# EasyEDA Pro project ProPrj_Hitboard PCB v2_right_2026-01-14.epro

# Board PCB1
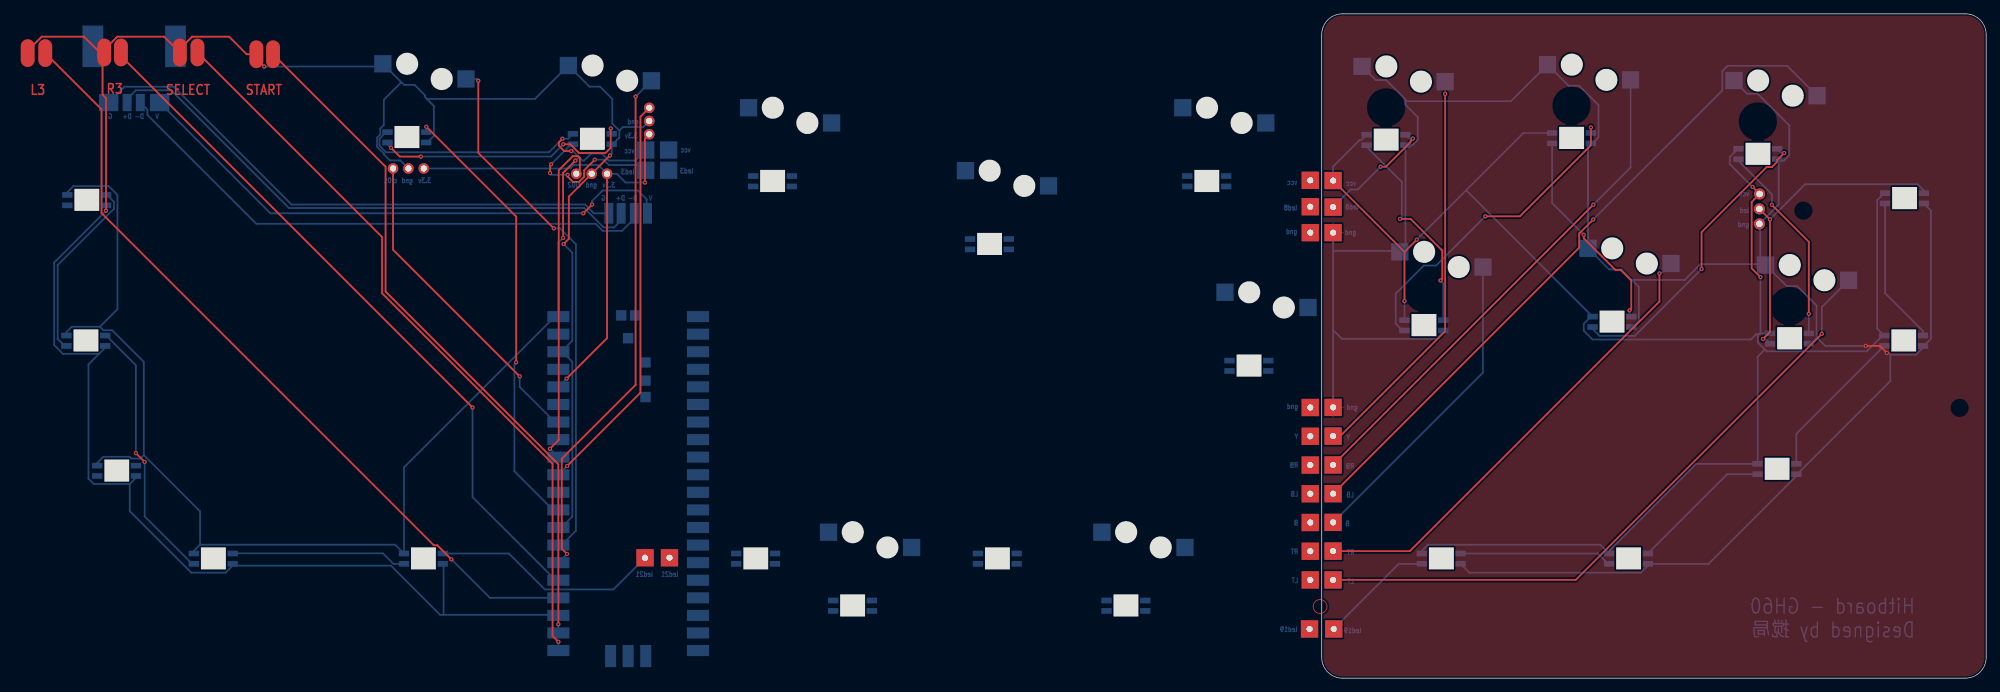
[diagram p0: board, top side]
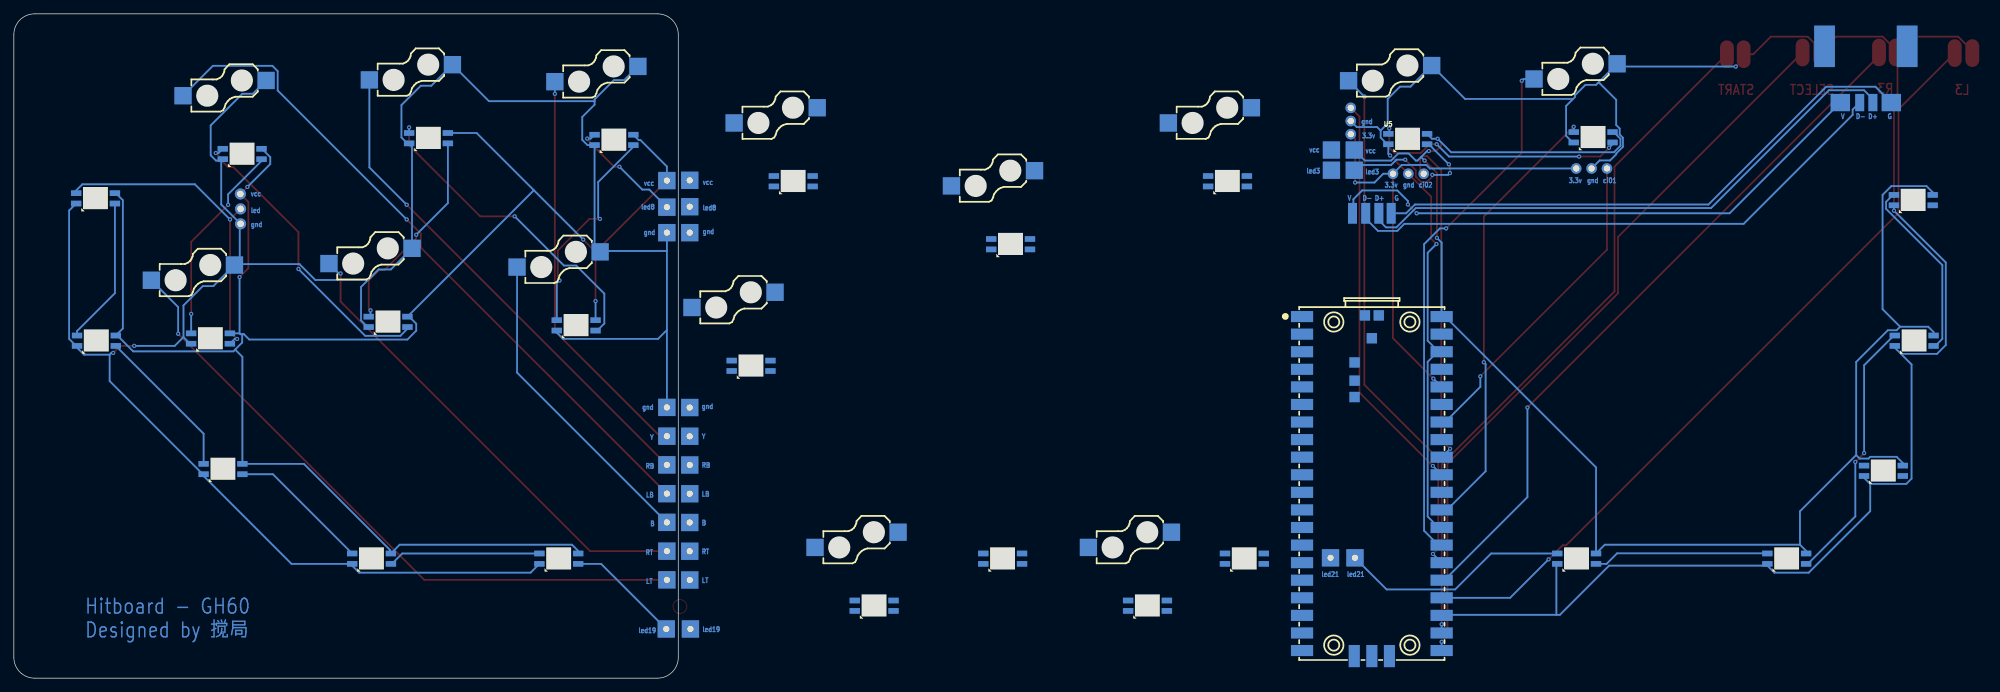
[diagram p1: board, bottom side, seen from below]

Outline 276.35 x 96 mm; copper layers: Top Layer, Bottom Layer. Coordinates in mm from the lower left corner of the outline.
Outline path: 180.35,93 arc(181.23,95.12) 183.35,96 273.35,96 arc(275.47,95.12) 276.35,93 276.35,3 arc(275.47,0.88) 273.35,0 183.35,0 arc(181.23,0.88) 180.35,3 180.35,93
Stack: Top Layer 0.035mm / Dielectric1 1.51mm FR4 er 4.5 / Bottom Layer 0.035mm

## Design rules (mm)
template: JLCPCB Capability(Two Layers Board)
spacing copperThickness1oz (default): track to track 0.102, other pairs 0.152 to 0.3
spacing copperThickness2oz: track to track 0.203, other pairs 0.152 to 0.3
track width copperThickness1oz (default): min 0.127, default 0.254, max 2.54
track width copperThickness2oz: min 0.203, default 0.254, max 2.54
differential pair differentialPair (default): width min 0.127, default 0.254, max 2.54; gap min 0.152, default 0.152
via viaSize (default): diameter min 0.5, default 0.61, max 10; hole min 0.3, default 0.305, max 6.3

## Placement (name value [footprint] x y rotation side)
NOREF  -  [Pad_e295]  50.62 73.65 0 top
NOREF#2  -  [Pad_e677]  4.45 90.42 0 top
NOREF#3  -  [Pad_e13605]  178.69 26.65 0 top
NOREF#4  -  [Pad_e681]  26.42 90.16 0 top
NOREF#5  -  [Pad_e13637]  182 71.91 0 top
NOREF#6  -  [Pad_e70]  182 30.82 0 top
NOREF#7  -  [Pad_e46]  77.09 72.89 0 top
NOREF#8  -  [Pad_e13607]  178.69 18.34 0 top
NOREF#9  -  [Pad_e68]  182 39.13 0 top
NOREF#10  -  [Pad_e48]  72.65 72.89 0 top
NOREF#11  -  [Pad_e693]  81.03 67.18 180 top
NOREF#12  -  [Pad_e689]  77.35 67.18 180 top
NOREF#13  -  [Pad_e676]  -4.08 90.33 0 top
NOREF#14  -  [Pad_e297]  46.17 73.65 0 top
NOREF#15  -  [Pad_e61148]  243.59 65.65 0 top
NOREF#16  -  [Pad_e678]  6.86 90.42 0 top
NOREF#17  -  [Pad_e687]  85.98 76.32 0 top
NOREF#18  -  [Pad_e691]  79.13 67.18 180 top
NOREF#19  -  [Pad_e6738]  82.68 73.4 0 top
NOREF#20  -  [Pad_e4881]  86.11 17.39 0 top
NOREF#21  -  [Pad_e13608]  178.69 14.19 0 top
NOREF#22  -  [Pad_e13602]  178.69 64.38 0 top
NOREF#23  -  [Pad_e13636]  182 64.38 0 top
NOREF#24  -  [Pad_e69]  182 34.97 0 top
NOREF#25  -  [Pad_e686]  12.45 83.18 180 top
NOREF#26  -  [Pad_e4875]  182.09 7.11 0 top
NOREF#27  -  [Pad_e294]  74.87 72.89 0 top
NOREF#28  -  [Pad_e682]  28.84 90.16 0 top
NOREF#29  -  [Pad_e683]  5.09 83.18 180 top
NOREF#30  -  [Pad_e300]  83.19 80.51 0 top
NOREF#31  -  [Pad_e74]  182 14.2 0 top
NOREF#32  -  [Pad_e301]  83.19 82.42 0 top
NOREF#33  -  [Pad_e675]  -6.62 90.33 0 top
NOREF#34  -  [Pad_e13603]  178.69 34.96 0 top
NOREF#35  -  [Pad_e4879]  82.58 17.39 0 top
NOREF#36  -  [Pad_e13606]  178.69 22.49 0 top
NOREF#37  -  [Pad_e71]  182 26.66 0 top
NOREF#38  -  [Pad_e679]  15.37 90.42 0 top
NOREF#39  -  [Pad_e13635]  182 68.07 0 top
NOREF#40  -  [Pad_e61147]  243.59 67.81 0 top
NOREF#41  -  [Pad_e685]  9.66 83.18 180 top
NOREF#42  -  [Pad_e73]  182 18.36 0 top
NOREF#43  -  [Pad_e13601]  178.69 68.13 0 top
NOREF#44  -  [Pad_e61146]  243.62 69.97 0 top
NOREF#45  -  [Pad_e53994]  14.74 91.31 180 top
NOREF#46  -  [Pad_e684]  7.75 83.18 180 top
NOREF#47  -  [Pad_e296]  48.39 73.65 0 top
NOREF#48  -  [Pad_e694]  82.94 67.18 180 top
NOREF#49  -  [Pad_e680]  17.91 90.42 0 top
NOREF#50  -  [Pad_e6736]  82.68 76.32 0 top
NOREF#51  -  [Pad_e53995]  2.8 91.31 180 top
NOREF#52  -  [Pad_e13604]  178.69 30.8 0 top
NOREF#53  -  [Pad_e299]  83.19 78.61 0 top
NOREF#54  -  [Pad_e13600]  178.69 71.94 0 top
NOREF#55  -  [Pad_e6737]  85.98 73.4 0 top
NOREF#56  -  [Pad_e72]  182 22.51 0 top
NOREF#57  -  [Pad_e4877]  178.59 7.11 0 top
NOREF#58  -  [Pad_e114539]  178.69 39.11 0 top
U1  PICO  [COMM-SMD_L51.0-W21.0-P2.54_SC0916]  80.14 27.81 270 bottom
U5  -  [LED-SMD_L3.2-W2.8_YO-WS2812B-3528]  132.34 62.71 180 bottom
U5#2  -  [LED-SMD_L3.2-W2.8_YO-WS2812B-3528]  264.55 69.34 180 bottom
U5#3  -  [LED-SMD_L3.2-W2.8_YO-WS2812B-3528]  264.42 48.76 180 bottom
U5#4  -  [LED-SMD_L3.2-W2.8_YO-WS2812B-3528]  246.13 30.22 180 bottom
U5#5  -  [LED-SMD_L3.2-W2.8_YO-WS2812B-3528]  197.62 17.27 180 bottom
U5#6  -  [LED-SMD_L3.2-W2.8_YO-WS2812B-3528]  133.48 17.27 180 bottom
U5#7  -  [LED-SMD_L3.2-W2.8_YO-WS2812B-3528]  98.56 17.27 180 bottom
U5#8  -  [LED-SMD_L3.2-W2.8_YO-WS2812B-3528]  50.55 17.27 180 bottom
U5#9  -  [LED-SMD_L3.2-W2.8_YO-WS2812B-3528]  20.2 17.27 180 bottom
U5#10  -  [LED-SMD_L3.2-W2.8_YO-WS2812B-3528]  1.78 48.76 180 bottom
U5#11  -  [LED-SMD_L3.2-W2.8_YO-WS2812B-3528]  1.91 69.08 180 bottom
U5#12  -  [LED-SMD_L3.2-W2.8_YO-WS2812B-3528]  6.23 29.97 180 bottom
U5#13  -  [LED-SMD_L3.2-W2.8_YO-WS2812B-3528]  224.67 17.27 180 bottom
U5#14  -  [LED-SMD_L3.2-W2.8_YO-WS2812B-3528]  48.17 78.16 180 bottom
U5#15  -  [LED-SMD_L3.2-W2.8_YO-WS2812B-3528]  74.96 77.91 180 bottom
U5#16  -  [LED-SMD_L3.2-W2.8_YO-WS2812B-3528]  101 71.81 180 bottom
U5#17  -  [LED-SMD_L3.2-W2.8_YO-WS2812B-3528]  112.56 10.47 180 bottom
U5#18  -  [LED-SMD_L3.2-W2.8_YO-WS2812B-3528]  152.05 10.47 180 bottom
U5#19  -  [LED-SMD_L3.2-W2.8_YO-WS2812B-3528]  163.74 71.81 180 bottom
U5#20  -  [LED-SMD_L3.2-W2.8_YO-WS2812B-3528]  169.83 45.14 180 bottom
U5#21  -  [LED-SMD_L3.2-W2.8_YO-WS2812B-3528]  189.64 77.78 180 bottom
U5#22  -  [LED-SMD_L3.2-W2.8_YO-WS2812B-3528]  195.11 50.98 180 bottom
U5#23  -  [LED-SMD_L3.2-W2.8_YO-WS2812B-3528]  216.44 78.03 180 bottom
U5#24  -  [LED-SMD_L3.2-W2.8_YO-WS2812B-3528]  222.28 51.49 180 bottom
U5#25  -  [LED-SMD_L3.2-W2.8_YO-WS2812B-3528]  243.37 75.75 180 bottom
U5#26  -  [LED-SMD_L3.2-W2.8_YO-WS2812B-3528]  247.94 49.08 180 bottom
U6  -  [CONN-SMD_HOTPLUGPAKAGE__C9900010116-1]  134.88 72.24 180 bottom
U6#2  -  [CONN-SMD_HOTPLUGPAKAGE__C9900010116-1]  50.71 87.68 180 bottom
U6#3  -  [CONN-SMD_HOTPLUGPAKAGE__C9900010116-1]  77.5 87.43 180 bottom
U6#4  -  [CONN-SMD_HOTPLUGPAKAGE__C9900010116-1]  103.54 81.33 180 bottom
U6#5  -  [CONN-SMD_HOTPLUGPAKAGE__C9900010116-1]  115.1 19.99 180 bottom
U6#6  -  [CONN-SMD_HOTPLUGPAKAGE__C9900010116-1]  154.59 19.99 180 bottom
U6#7  -  [CONN-SMD_HOTPLUGPAKAGE__C9900010116-1]  166.28 81.33 180 bottom
U6#8  -  [CONN-SMD_HOTPLUGPAKAGE__C9900010116-1]  172.37 54.66 180 bottom
U6#9  -  [CONN-SMD_HOTPLUGPAKAGE__C9900010116-1]  192.18 87.3 180 bottom
U6#10  -  [CONN-SMD_HOTPLUGPAKAGE__C9900010116-1]  197.65 60.51 180 bottom
U6#11  -  [CONN-SMD_HOTPLUGPAKAGE__C9900010116-1]  218.98 87.56 180 bottom
U6#12  -  [CONN-SMD_HOTPLUGPAKAGE__C9900010116-1]  224.82 61.01 180 bottom
U6#13  -  [CONN-SMD_HOTPLUGPAKAGE__C9900010116-1]  245.91 85.27 180 bottom
U6#14  -  [CONN-SMD_HOTPLUGPAKAGE__C9900010116-1]  250.48 58.6 180 bottom

## Footprints (pads in the part's own frame, mm; a bottom-side part is the same pattern mirrored in y, then rotated)
COMM-SMD_L51.0-W21.0-P2.54_SC0916
  rect 1.6x3.2 smd: 1(-24.445,-10.088) 2(-21.905,-10.088) 3(-19.365,-10.088) 4(-16.825,-10.088) 5(-14.285,-10.088) 6(-11.745,-10.088) 7(-9.205,-10.088) 8(-6.665,-10.088) 9(-4.125,-10.088) 10(-1.585,-10.088) 11(0.955,-10.088) 12(3.495,-10.088) 13(6.035,-10.088) 14(8.575,-10.088) 15(11.115,-10.088) 16(13.655,-10.088) 17(16.195,-10.088) 18(18.735,-10.088) 19(21.275,-10.088) 20(23.815,-10.088) 21(23.815,10.088) 22(21.275,10.088) 23(18.735,10.088) 24(16.195,10.088) 25(13.655,10.088) 26(11.115,10.088) 27(8.575,10.088) 28(6.035,10.088) 29(3.495,10.088) 30(0.955,10.088) 31(-1.585,10.088) 32(-4.125,10.088) 33(-6.665,10.088) 34(-9.205,10.088) 35(-11.745,10.088) 36(-14.285,10.088) 37(-16.825,10.088) 38(-19.365,10.088) 39(-21.905,10.088) 40(-24.445,10.088)
  rect 3.2x1.6 smd: 41(24.615,-2.54) 42(24.615,0) 43(24.615,2.54)
  rect 1.5x1.5 smd: TP1(-21.315,0) TP2(-24.615,1) TP3(-24.615,-1) TP4(-17.815,-2.5) TP5(-15.188,-2.5) TP6(-12.815,-2.5)
CONN-SMD_HOTPLUGPAKAGE__C9900010116-1
  rect 2.5x2.5 smd: 1(-6,-1.1) 2(6,1.1)
LED-SMD_L3.2-W2.8_YO-WS2812B-3528
  rect 1.5x0.82 smd: 1(2.8,0.75) 2(2.8,-0.75) 3(-2.8,-0.75) 4(-2.8,0.75)
Pad_e46
  round 1.524 hole 0.914: 1(0,0)
Pad_e48
  round 1.524 hole 0.914: 1(0,0)
Pad_e68
  rect 2.5x2.5 hole 0.9: PTH(0,0)
Pad_e69
  rect 2.5x2.5 hole 0.9: PTH(0,0)
Pad_e70
  rect 2.5x2.5 hole 0.9: PTH(0,0)
Pad_e71
  rect 2.5x2.5 hole 0.9: PTH(0,0)
Pad_e72
  rect 2.5x2.5 hole 0.9: PTH(0,0)
Pad_e73
  rect 2.5x2.5 hole 0.9: PTH(0,0)
Pad_e74
  rect 2.5x2.5 hole 0.9: PTH(0,0)
Pad_e294
  round 1.524 hole 0.914: 1(0,0)
Pad_e295
  round 1.524 hole 0.914: 1(0,0)
Pad_e296
  round 1.524 hole 0.914: 1(0,0)
Pad_e297
  round 1.524 hole 0.914: 1(0,0)
Pad_e299
  round 1.524 hole 0.914: 1(0,0)
Pad_e300
  round 1.524 hole 0.914: 1(0,0)
Pad_e301
  round 1.524 hole 0.914: 1(0,0)
Pad_e675
  oval 2x4 smd: 1(0,0)
Pad_e676
  oval 2x4 smd: 1(0,0)
Pad_e677
  oval 2x4 smd: 1(0,0)
Pad_e678
  oval 2x4 smd: 1(0,0)
Pad_e679
  oval 2x4 smd: 1(0,0)
Pad_e680
  oval 2x4 smd: 1(0,0)
Pad_e681
  oval 2x4 smd: 1(0,0)
Pad_e682
  oval 2x4 smd: 1(0,0)
Pad_e683
  rect 2.8x2.5 smd far side: PTH(0,0)
Pad_e684
  rect 1.3x2.5 smd far side: PTH(0,0)
Pad_e685
  rect 1.3x2.5 smd far side: PTH(0,0)
Pad_e686
  rect 2.8x2.5 smd far side: PTH(0,0)
Pad_e687
  rect 2.5x2.5 smd far side: PTH(0,0)
Pad_e689
  rect 1.3x3 smd far side: PTH(0,0)
Pad_e691
  rect 1.3x3 smd far side: PTH(0,0)
Pad_e693
  rect 1.3x3 smd far side: PTH(0,0)
Pad_e694
  rect 1.3x3 smd far side: PTH(0,0)
Pad_e4875
  rect 2.5x2.5 hole 0.9: PTH(0,0)
Pad_e4877
  rect 2.5x2.5 hole 0.9: PTH(0,0)
Pad_e4879
  rect 2.5x2.5 hole 0.9: PTH(0,0)
Pad_e4881
  rect 2.5x2.5 hole 0.9: PTH(0,0)
Pad_e6736
  rect 2.5x2.5 smd far side: PTH(0,0)
Pad_e6737
  rect 2.5x2.5 smd far side: PTH(0,0)
Pad_e6738
  rect 2.5x2.5 smd far side: PTH(0,0)
Pad_e13600
  rect 2.5x2.5 hole 0.9: PTH(0,0)
Pad_e13601
  rect 2.5x2.5 hole 0.9: PTH(0,0)
Pad_e13602
  rect 2.5x2.5 hole 0.9: PTH(0,0)
Pad_e13603
  rect 2.5x2.5 hole 0.9: PTH(0,0)
Pad_e13604
  rect 2.5x2.5 hole 0.9: PTH(0,0)
Pad_e13605
  rect 2.5x2.5 hole 0.9: PTH(0,0)
Pad_e13606
  rect 2.5x2.5 hole 0.9: PTH(0,0)
Pad_e13607
  rect 2.5x2.5 hole 0.9: PTH(0,0)
Pad_e13608
  rect 2.5x2.5 hole 0.9: PTH(0,0)
Pad_e13635
  rect 2.5x2.5 hole 0.9: PTH(0,0)
Pad_e13636
  rect 2.5x2.5 hole 0.9: PTH(0,0)
Pad_e13637
  rect 2.5x2.5 hole 0.9: PTH(0,0)
Pad_e53994
  rect 3x6 smd far side: PTH(0,0)
Pad_e53995
  rect 3x6 smd far side: PTH(0,0)
Pad_e61146
  round 1.6 hole 0.96: PTH(0,0)
Pad_e61147
  round 1.6 hole 0.96: PTH(0,0)
Pad_e61148
  round 1.6 hole 0.96: PTH(0,0)
Pad_e114539
  rect 2.5x2.5 hole 0.9: PTH(0,0)

## Nets
3V3: NOREF.1 NOREF#7.1 NOREF#53.1 U1.36
GND: NOREF#2.1 NOREF#4.1 NOREF#9.PTH NOREF#15.PTH NOREF#22.PTH NOREF#23.PTH NOREF#27.1 NOREF#30.1 NOREF#33.1 NOREF#38.1 NOREF#47.1 NOREF#58.PTH U1.3 U1.8 U1.18 U1.23 U1.28 U1.38 U5.3 U5#2.3 U5#3.3 U5#4.3 U5#5.3 U5#6.3 U5#7.3 U5#8.3 U5#9.3 U5#10.3 U5#11.3 U5#12.3 U5#13.3 U5#14.3 U5#15.3 U5#16.3 U5#17.3 U5#18.3 U5#19.3 U5#20.3 U5#21.3 U5#22.3 U5#23.3 U5#24.3 U5#25.3 U5#26.3 U6.2 U6#2.2 U6#3.2 U6#4.2 U6#5.2 U6#6.2 U6#7.2 U6#8.2 U6#9.2 U6#10.2 U6#11.2 U6#12.2 U6#13.2 U6#14.2
VCC: NOREF#5.PTH NOREF#17.PTH NOREF#44.PTH NOREF#50.PTH NOREF#54.PTH U1.40 U5.1 U5#2.1 U5#3.1 U5#4.1 U5#5.1 U5#6.1 U5#7.1 U5#8.1 U5#9.1 U5#10.1 U5#11.1 U5#12.1 U5#13.1 U5#14.1 U5#15.1 U5#16.1 U5#17.1 U5#18.1 U5#19.1 U5#20.1 U5#21.1 U5#22.1 U5#23.1 U5#24.1 U5#25.1 U5#26.1
2: U5#14.2 U5#15.4
3: NOREF#19.PTH NOREF#55.PTH U5.4 U5#15.2 U5#16.4
4: U5.2 U5#16.2 U5#17.4
5: U5#17.2 U5#18.4
6: U5#18.2 U5#19.4
7: U5#19.2 U5#20.4
8: NOREF#39.PTH NOREF#43.PTH U5#20.2 U5#21.4
9: U5#21.2 U5#22.4
10: U5#22.2 U5#23.4
11: U5#23.2 U5#24.4
12: U5#24.2 U5#25.4
13: U5#25.2 U5#26.4
14: NOREF#40.PTH U5#2.4 U5#12.4 U5#26.2
15: U5#2.2 U5#3.4 U5#12.2
16: U5#3.2 U5#4.4
17: U5#4.2 U5#13.4
18: U5#5.4 U5#13.2
19: NOREF#26.PTH NOREF#57.PTH U5#5.2 U5#6.4
20: U5#6.2 U5#7.4
21: NOREF#20.PTH NOREF#35.PTH U5#7.2 U5#8.4
22: U5#8.2 U5#9.4
23: U5#9.2 U5#10.4
24: U5#10.2 U5#11.4
25: U5#11.2
A: U1.9 U6#8.1
B: NOREF#36.PTH NOREF#56.PTH U1.10 U6#10.1
BUTTON1: U1.5 U6#5.1
BUTTON2: U1.7 U6.1
D+: NOREF#18.PTH NOREF#46.PTH
D-: NOREF#11.PTH NOREF#41.PTH
DOWN: U1.26 U6#3.1
G: NOREF#12.PTH NOREF#29.PTH
L3: NOREF#13.1 U1.24
LB: NOREF#3.PTH NOREF#37.PTH U1.17 U6#13.1
LED1: U1.29 U5#14.4
LEFT: U1.27 U6#2.1
LINEBUTTON01: NOREF#14.1 U1.34
LINEBUTTON02: NOREF#10.1 U1.32
LINEBUTTON03: NOREF#32.1 U1.31
LT: NOREF#21.PTH NOREF#31.PTH U1.12 U6#14.1
R3: NOREF#16.1 U1.25
RB: NOREF#6.PTH NOREF#52.PTH U1.16 U6#11.1
RIGHT: U1.6 U6#4.1
RT: NOREF#8.PTH NOREF#42.PTH U1.11 U6#12.1
SELECT: NOREF#49.1 U1.21
START: NOREF#28.1 U1.22
UP: U1.4 U6#6.1
V: NOREF#25.PTH NOREF#48.PTH
X: U1.14 U6#7.1
Y: NOREF#24.PTH NOREF#34.PTH U1.15 U6#9.1

Pads without a net: NOREF#45 PTH; NOREF#51 PTH; U1 1 2 13 19 20 30 33 35 37 39 41 42 43 TP1 TP2 TP3 TP4 TP5 TP6

## Via types
v1: diameter 0.61, hole 0.305, Top Layer to Bottom Layer, 60 vias

## Routing (per net, layer and track width the routed paths; a pad name or vN(x,y) marks a point on that pad's centre or on a via; arc(x,y) is an arc through that point)
3V3: length 74.2
  Top Layer w0.254: NOREF#7.1 77.09,49.13 v1(71.25,43.29) ; v1(82.56,71.62) 82.56,77.97 NOREF#53.1
  Bottom Layer w0.254: v1(82.56,71.62) 79.76,71.62 78.49,72.89 NOREF#7.1 75.83,74.16 72.27,74.16 71.76,73.65 NOREF.1 ; v1(71.25,43.29) U1.36
GND: length 699.8
  Top Layer w0.254: 26.3,90.16 NOREF#4.1 ; 26.3,90.16 26.3,89.66 v1(27.57,88.39) ; 26.3,90.16 25.03,90.16 22.48,92.7 17.15,92.7 15.37,90.93 NOREF#38.1 13.09,92.7 6.34,92.7 4.31,90.67 4.31,90.42 ; 4.31,90.42 3.8,90.42 1.51,92.7 -4.58,92.7 -6.62,90.67 NOREF#33.1 ; 4.31,90.42 NOREF#2.1 4.2,90.16 4.2,84.32 4.71,83.81 v1(4.71,67.56) ; v1(258.96,48.02) 260.99,48.02 v1(262,47) ; v1(77.51,75.53) NOREF#27.1 71.57,69.59 71.57,63.49 v1(70.81,62.73)
  Bottom Layer w0.254: 53.48,9.15 69.98,9.15 U1.23 ; 53.48,9.15 53.48,16.39 U5#8.3 ; 53.48,9.15 52.97,9.15 45.86,16.26 23,16.26 ; v1(258.96,48.02) 253.11,48.02 251.84,49.29 ; 262.51,46.75 262.51,42.94 249.17,29.59 249.06,29.59 U5#4.3 248.93,29.22 236.23,16.52 U5#13.3 227.47,16.26 226.45,15.25 201.69,15.25 U5#5.3 ; 262.51,46.75 266.21,46.75 267.11,47.64 267.11,47.9 U5#3.3 267.35,48.01 268.36,49.03 268.36,67.57 267.35,68.59 ; 262.51,46.75 262.26,47 v1(262,47) ; 243.72,59.83 244.35,59.83 U6#14.2 247.53,56.65 249.05,56.65 251.84,53.86 251.84,49.29 ; 243.72,59.83 235.08,59.83 232.79,57.54 225.17,57.54 ; 243.72,59.83 243.72,65.53 NOREF#15.PTH 246.39,68.45 246.39,74.8 ; 246.39,74.8 247.15,74.8 247.91,75.56 247.91,79.88 243.34,84.45 241.83,84.45 U6#13.2 ; 246.39,74.8 U5#25.3 ; v1(70.81,62.73) 72.08,61.46 72.08,48.76 70.55,47.24 ; U5#14.3 51.11,77.41 52.07,78.37 52.07,82.69 51.06,83.7 ; 8.13,28.07 8.13,24.14 17.02,15.25 21.98,15.25 23,16.26 ; 8.13,28.07 2.93,28.07 2.17,28.83 2.17,45.34 3.69,46.86 ; 8.13,28.07 9.03,28.96 U5#12.3 ; U5#10.3 4.58,47.76 3.69,46.86 ; 182,61.73 NOREF#23.PTH ; 182,61.73 191.52,61.73 ; 182,61.73 182,50.3 ; U5#24.3 225.23,50.74 226.19,51.7 226.19,56.53 225.17,57.54 ; U1.38 70.12,47.24 70.55,47.24 ; 78.87,79.13 77.85,80.15 77.85,83.7 76.08,85.48 74.55,85.48 U6#3.2 66.68,83.7 51.06,83.7 ; 78.87,79.13 79.38,79.64 82.32,79.64 NOREF#30.1 ; 78.87,79.13 78.87,78.12 77.91,77.16 U5#15.3 77.76,75.78 v1(77.51,75.53) ; 23,16.26 U5#9.3 ; 70.55,47.24 72.08,45.71 72.08,23.36 70.49,21.77 U1.28 ; 192.44,83.38 192.44,82.87 194.22,81.09 194.22,77.79 193.46,77.03 U5#21.3 192.44,62.66 191.52,61.73 ; 192.44,83.38 192.44,83.63 189.65,86.43 188.16,86.43 U6#9.2 ; 192.44,83.38 207.7,83.38 U6#11.2 216.03,85.61 217.55,85.61 220.35,82.81 220.35,78.13 219.5,77.28 U5#23.3 218.82,76.86 U6#12.2 221.87,59.07 223.65,59.07 225.17,57.54 ; 3.69,46.86 -1.51,46.86 -2.78,48.13 -2.78,60.07 v1(4.71,67.56) 4.71,68.33 ; 251.84,49.29 250.88,48.33 U5#26.3 ; NOREF#47.1 47.23,74.81 45.72,74.81 44.84,75.7 44.84,75.82 43.87,76.79 43.87,78.1 44.34,78.57 44.34,79.43 44.84,79.93 44.84,83.58 47.25,85.99 47.5,85.99 ; 47.5,85.99 47.75,85.74 49.28,85.74 50.8,84.21 50.8,83.96 51.06,83.7 ; 47.5,85.99 U6#2.2 44.31,88.39 v1(27.57,88.39) ; U5#22.3 197.91,49.95 196.98,49.03 183.27,49.03 182,50.3 ; 191.52,61.73 U6#10.2 ; NOREF#9.PTH 182,50.3
VCC: length 491
  Top Layer w0.254: 192.31,61.6 v1(192.31,54.49) ; 192.31,61.6 v1(194.08,63.38) ; 192.31,61.6 NOREF#5.PTH ; v1(242.6,70.99) NOREF#44.PTH 242.47,68.82 242.47,59.22 v1(243.74,57.95) ; v1(71.91,76.17) 70.89,76.17 70.13,76.93 70.13,77.44 v1(70.64,77.95) ; v1(72.52,74.8) 70.75,73.02 v1(70.75,63.62)
  Bottom Layer w0.254: 243.74,49.83 v1(243.74,57.95) ; 243.74,49.83 243.61,49.7 243.36,49.7 ; 243.74,49.83 U5#26.1 ; 73.03,75.31 v1(72.52,74.8) ; 73.03,75.31 73.54,74.8 73.79,74.8 74.81,75.81 76.33,75.81 77.35,74.8 81.16,74.8 NOREF#50.PTH ; 73.03,75.31 72.16,76.17 v1(71.91,76.17) ; -0.89,69.83 -0.89,70.21 0,71.1 5.08,71.1 6.35,69.83 6.35,53.32 3.81,50.78 ; 10.16,32.24 18.29,24.11 18.29,19.29 ; 10.16,32.24 10.16,45.7 5.59,50.27 4.32,50.27 3.81,50.78 ; 10.16,32.24 9.65,31.73 8.38,31.73 8.13,31.99 4.32,31.99 3.43,31.1 U5#12.1 ; 3.81,50.78 -0.25,50.78 -1.02,50.02 U5#10.1 ; 243.36,49.7 243.11,49.7 242.34,48.94 219.48,48.94 218.21,50.21 218.21,51.22 219.23,52.24 U5#24.1 201.23,70.49 201.2,70.49 ; 243.36,49.7 243.36,48.5 244.38,47.48 ; 18.29,19.29 17.4,18.4 U5#9.1 ; 18.29,19.29 46.48,19.29 U5#8.1 47.75,30.46 69.55,52.25 U1.40 70.06,62.93 v1(70.75,63.62) ; 244.38,47.48 244.63,47.23 259.11,47.23 261.39,49.51 U5#3.1 260.6,50.53 260.6,69.07 261.62,70.09 U5#2.1 ; 244.38,47.48 243.33,46.44 U5#4.1 234.44,30.97 222,18.52 222,18.14 U5#13.1 220.6,19.29 195.71,19.29 194.82,18.4 U5#5.1 ; NOREF#5.PTH 182,73.94 185.81,77.75 186.07,77.75 U5#21.1 ; v1(242.6,70.99) 239.3,74.29 239.3,75.31 240.49,76.5 U5#25.1 ; 201.2,70.49 209.49,78.78 U5#23.1 ; 201.2,70.49 v1(194.08,63.38) ; v1(192.31,54.49) U5#22.1 ; U5#14.1 45.18,78.91 44.22,77.95 44.22,76.93 45.16,75.99 68.68,75.99 v1(70.64,77.95) 71.46,77.95 U5#15.1
2: length 38.5
  Top Layer w0.254: v1(70.77,77.16) 71.78,77.16 73.05,75.89 76.86,75.89 77.62,76.65 v1(77.62,79.44) ; v1(50.19,75.38) 47.14,75.38 v1(45.87,76.65)
  Bottom Layer w0.254: U5#14.2 45.37,77.16 v1(45.87,76.65) ; v1(70.77,77.16) 68.99,75.38 v1(50.19,75.38) ; v1(77.62,79.44) 77.62,78.79 U5#15.4
3: length 22.7
  Top Layer w0.254: v1(71.4,72.73) 71.4,72.48 72.16,71.72 73.03,71.72 73.79,72.48 73.79,73.4 v1(75.32,74.92) ; v1(68.86,72.99) 68.86,74.11 v1(69.01,74.26)
  Bottom Layer w0.254: v1(69.01,74.26) 71.91,77.16 U5#15.2 ; v1(71.4,72.73) 69.12,72.73 v1(68.86,72.99) ; v1(75.32,74.92) 76.59,74.92 77.35,74.16 81.92,74.16 NOREF#19.PTH
8: length 17
  Top Layer w0.254: v1(193.51,77.97) 193.19,77.65 193.19,77.48 189.62,73.91 v1(188.85,73.91)
  Bottom Layer w0.254: v1(193.51,77.97) 193,77.97 U5#21.4 ; v1(188.85,73.91) 185.55,70.61 184.54,70.61 NOREF#39.PTH
9: length 31.2
  Top Layer w0.254: v1(197.51,57.47) 197.77,57.72 197.77,61.79 193.19,66.36 v1(191.67,66.36)
  Bottom Layer w0.254: U5#22.4 197.91,57.08 v1(197.51,57.47) ; U5#21.2 186.84,76.77 191.92,71.69 191.92,66.61 v1(191.67,66.36)
10: length 46.5
  Top Layer w0.254: v1(203.99,66.74) 208.98,66.74 219.24,77 v1(219.24,79.59)
  Bottom Layer w0.254: U5#22.2 192.05,50.23 191.04,51.25 191.04,55.56 195.1,59.63 196.88,59.63 v1(203.99,66.74) ; v1(219.24,79.59) U5#23.4
11: length 30.4
  Top Layer w0.254: v1(224.82,53.15) 225.07,53.41 225.07,57.47 223.55,58.99 222.79,58.99 218.21,63.57 v1(218.21,64.07)
  Bottom Layer w0.254: v1(224.82,53.15) 224.82,52.5 U5#24.4 ; U5#23.2 213.64,68.65 v1(218.21,64.07)
12: length 43.8
  Top Layer w0.254: v1(235.23,59.12) 235.23,64.45 244.63,73.85 245.39,73.85 246.15,74.61 246.15,74.87 v1(247.17,75.89)
  Bottom Layer w0.254: v1(235.23,59.12) 225.58,49.47 220.5,49.47 219.48,50.48 U5#24.2 ; v1(247.17,75.89) 246.78,75.89 U5#25.4
13: length 29.4
  Top Layer w0.254: v1(245.39,68.39) 250.73,63.06 v1(250.73,52.64)
  Bottom Layer w0.254: U5#26.4 250.73,49.84 v1(250.73,52.64) ; U5#25.2 240.57,74.74 245.39,69.92 v1(245.39,68.39)
14: length 46.3
  Top Layer w0.254: NOREF#40.PTH v1(245.12,66.29) 245.12,50.03 v1(244.1,49.02)
  Bottom Layer w0.254: U5#26.2 244.45,49.02 v1(244.1,49.02) ; v1(245.12,66.29) 250.2,71.37 266.45,71.37 267.35,70.47 267.35,70.09
15: length 21.3
  Bottom Layer w0.254: U5#3.4 267.22,50.16 261.75,55.63 U5#2.2
16: length 22.3
  Bottom Layer w0.254: U5#4.4 248.93,35.32 U5#3.2
17: length 20.6
  Bottom Layer w0.254: U5#4.2 238.92,29.47 U5#13.4
18: length 22.1
  Bottom Layer w0.254: U5#5.4 220.23,18.02 221.5,16.75 221.64,16.75 U5#13.2
19: length 16.6
  Bottom Layer w0.254: NOREF#26.PTH 191.5,16.52 U5#5.2
21: length 33.3
  Bottom Layer w0.254: U5#8.4 62.91,18.02 68.1,12.82 78.01,12.82 NOREF#35.PTH
22: length 25.4
  Bottom Layer w0.254: U5#8.2 46.23,16.52 44.7,18.04 23.02,18.04 U5#9.4
23: length 38.5
  Top Layer w0.254: v1(10.29,31.25) v1(9.02,32.52)
  Bottom Layer w0.254: v1(10.29,31.25) 10.29,23.37 17.15,16.52 U5#9.2 ; U5#10.4 4.68,49.42 4.82,49.42 9.02,45.22 v1(9.02,32.52)
24: length 26.4
  Bottom Layer w0.254: U5#11.4 4.81,69.74 4.94,69.74 5.84,68.84 5.84,67.82 -2.29,59.7 -2.29,49.03 -1.27,48.01 U5#10.2
B: length 45.9
  Bottom Layer w0.254: U6#10.1 203.65,44.16 NOREF#56.PTH
D+: length 82.1
  Bottom Layer w0.254: NOREF#18.PTH 79.13,66.16 78.11,65.14 76.59,65.14 73.79,67.94 31.12,67.94 14.1,84.96 9.02,84.96 7.75,83.69 NOREF#46.PTH
D-: length 81
  Bottom Layer w0.254: NOREF#11.PTH 81.03,66.42 79.25,64.64 76.46,64.64 75.44,65.65 26.42,65.65 10.67,81.4 10.67,82.16 NOREF#41.PTH
DOWN: length 75.8
  Top Layer w0.254: v1(81.22,84.04) 81.22,42.39 70.55,31.72 70.55,18.71 v1(71.31,17.95)
  Bottom Layer w0.254: v1(71.31,17.95) U1.26 ; U6#3.1 v1(81.22,84.04)
G: length 80.8
  Bottom Layer w0.254: NOREF#12.PTH 75.19,67.18 73.92,68.45 31.5,68.45 14.48,85.47 7.37,85.47 NOREF#29.PTH
L3: length 115.5
  Top Layer w0.254: NOREF#13.1 4.05,82.2 4.05,67.21 52.06,19.21 52.57,19.21 v1(54.6,17.17)
  Bottom Layer w0.254: U1.24 60.16,11.61 v1(54.6,17.17)
LB: length 100.1
  Top Layer w0.254: v1(219.59,66.29) 217.56,64.26 217.56,62.22 NOREF#37.PTH
  Bottom Layer w0.254: v1(219.59,66.29) 238.23,84.93 238.23,87.73 239,88.49 247.59,88.49 U6#13.1
LED1: length 64.7
  Top Layer w0.254: v1(63.96,45.65) 63.96,66.7 v1(50.98,79.68)
  Bottom Layer w0.254: v1(63.96,45.65) 63.71,45.39 63.71,29.9 69.29,24.31 U1.29 ; U5#14.4 50.98,78.92 v1(50.98,79.68)
LEFT: length 76.7
  Top Layer w0.254: v1(69.41,64.99) 58.48,75.92 v1(58.48,86.33)
  Bottom Layer w0.254: v1(69.41,64.99) 70.31,64.99 72.6,62.71 72.6,21.31 70.52,19.23 U1.27 ; U6#2.1 58.23,86.58 v1(58.48,86.33)
LINEBUTTON01: length 46.8
  Top Layer w0.254: NOREF#14.1 46.17,61.91 v1(64.47,43.62)
  Bottom Layer w0.254: U1.34 69.55,37.01 64.47,42.09 v1(64.47,43.62)
LINEBUTTON02: length 49
  Top Layer w0.254: v1(68.84,33.15) 70.11,34.42 70.11,73.4 72.14,75.43 72.9,75.43 73.16,75.18 73.16,73.4 NOREF#10.1
  Bottom Layer w0.254: v1(68.84,33.15) U1.32
LINEBUTTON03: length 58.5
  Top Layer w0.254: v1(71.33,30.66) 81.92,41.26 81.92,81.15 NOREF#32.1
  Bottom Layer w0.254: U1.31 v1(71.33,30.66)
LT: length 94.7
  Top Layer w0.254: NOREF#31.PTH 217.05,14.2 v1(252.61,49.76)
  Bottom Layer w0.254: v1(252.61,49.76) 252.61,53.63 U6#14.1
R3: length 102.7
  Top Layer w0.254: NOREF#16.1 6.86,89.91 v1(57.66,39.11)
  Bottom Layer w0.254: U1.25 69.99,14.22 69.6,14.22 57.66,26.16 v1(57.66,39.11)
RB: length 73.4
  Top Layer w0.254: NOREF#6.PTH v1(219.59,68.41)
  Bottom Layer w0.254: v1(219.59,68.41) 224.98,73.8 U6#11.1
RT: length 68.4
  Top Layer w0.254: NOREF#42.PTH 193.08,18.36 229.14,54.42 v1(229.14,58.49)
  Bottom Layer w0.254: v1(229.14,58.49) 229.4,58.49 U6#12.1
SELECT: length 108
  Top Layer w0.254: v1(70.06,5.26) 69.22,6.09 69.22,30.98 44.58,55.62 44.58,63.75 NOREF#49.1
  Bottom Layer w0.254: v1(70.06,5.26) U1.21
START: length 100.7
  Top Layer w0.254: v1(70.06,7.8) 70.06,30.91 45.09,55.87 45.09,73.91 NOREF#28.1
  Bottom Layer w0.254: v1(70.06,7.8) U1.22
V: length 81.3
  Top Layer w0.254: v1(73.67,67.18) v1(74.94,68.45)
  Bottom Layer w0.254: v1(74.94,68.45) 74.94,68.95 76.46,70.48 81.54,70.48 82.81,69.21 82.81,67.3 NOREF#48.PTH ; v1(73.67,67.18) 28.45,67.18 NOREF#25.PTH
Y: length 58.5
  Top Layer w0.254: v1(198.18,84.43) 198.18,50.14 183.01,34.97 NOREF#24.PTH
  Bottom Layer w0.254: v1(198.18,84.43) U6#9.1

## Copper pours and planes (outline as drawn; the poured copper is in the pictures)
GND on Top Layer: 176.79,99.69 278.77,99.69 278.77,-3.31 176.79,-3.31

## Text on the board
Bottom Layer: G | D+ | D- | V | ci01 | gnd | 3.3v | ci02 | vcc | led3 | led21 | led8 | led19 | Y | RB | LB | B | RT | LT | led | Hitboard - GH60 / Designed by 搅局
Top Layer: L3 | R3 | SELECT | START
